# EAGLE design untitled (EAGLE 6.4)
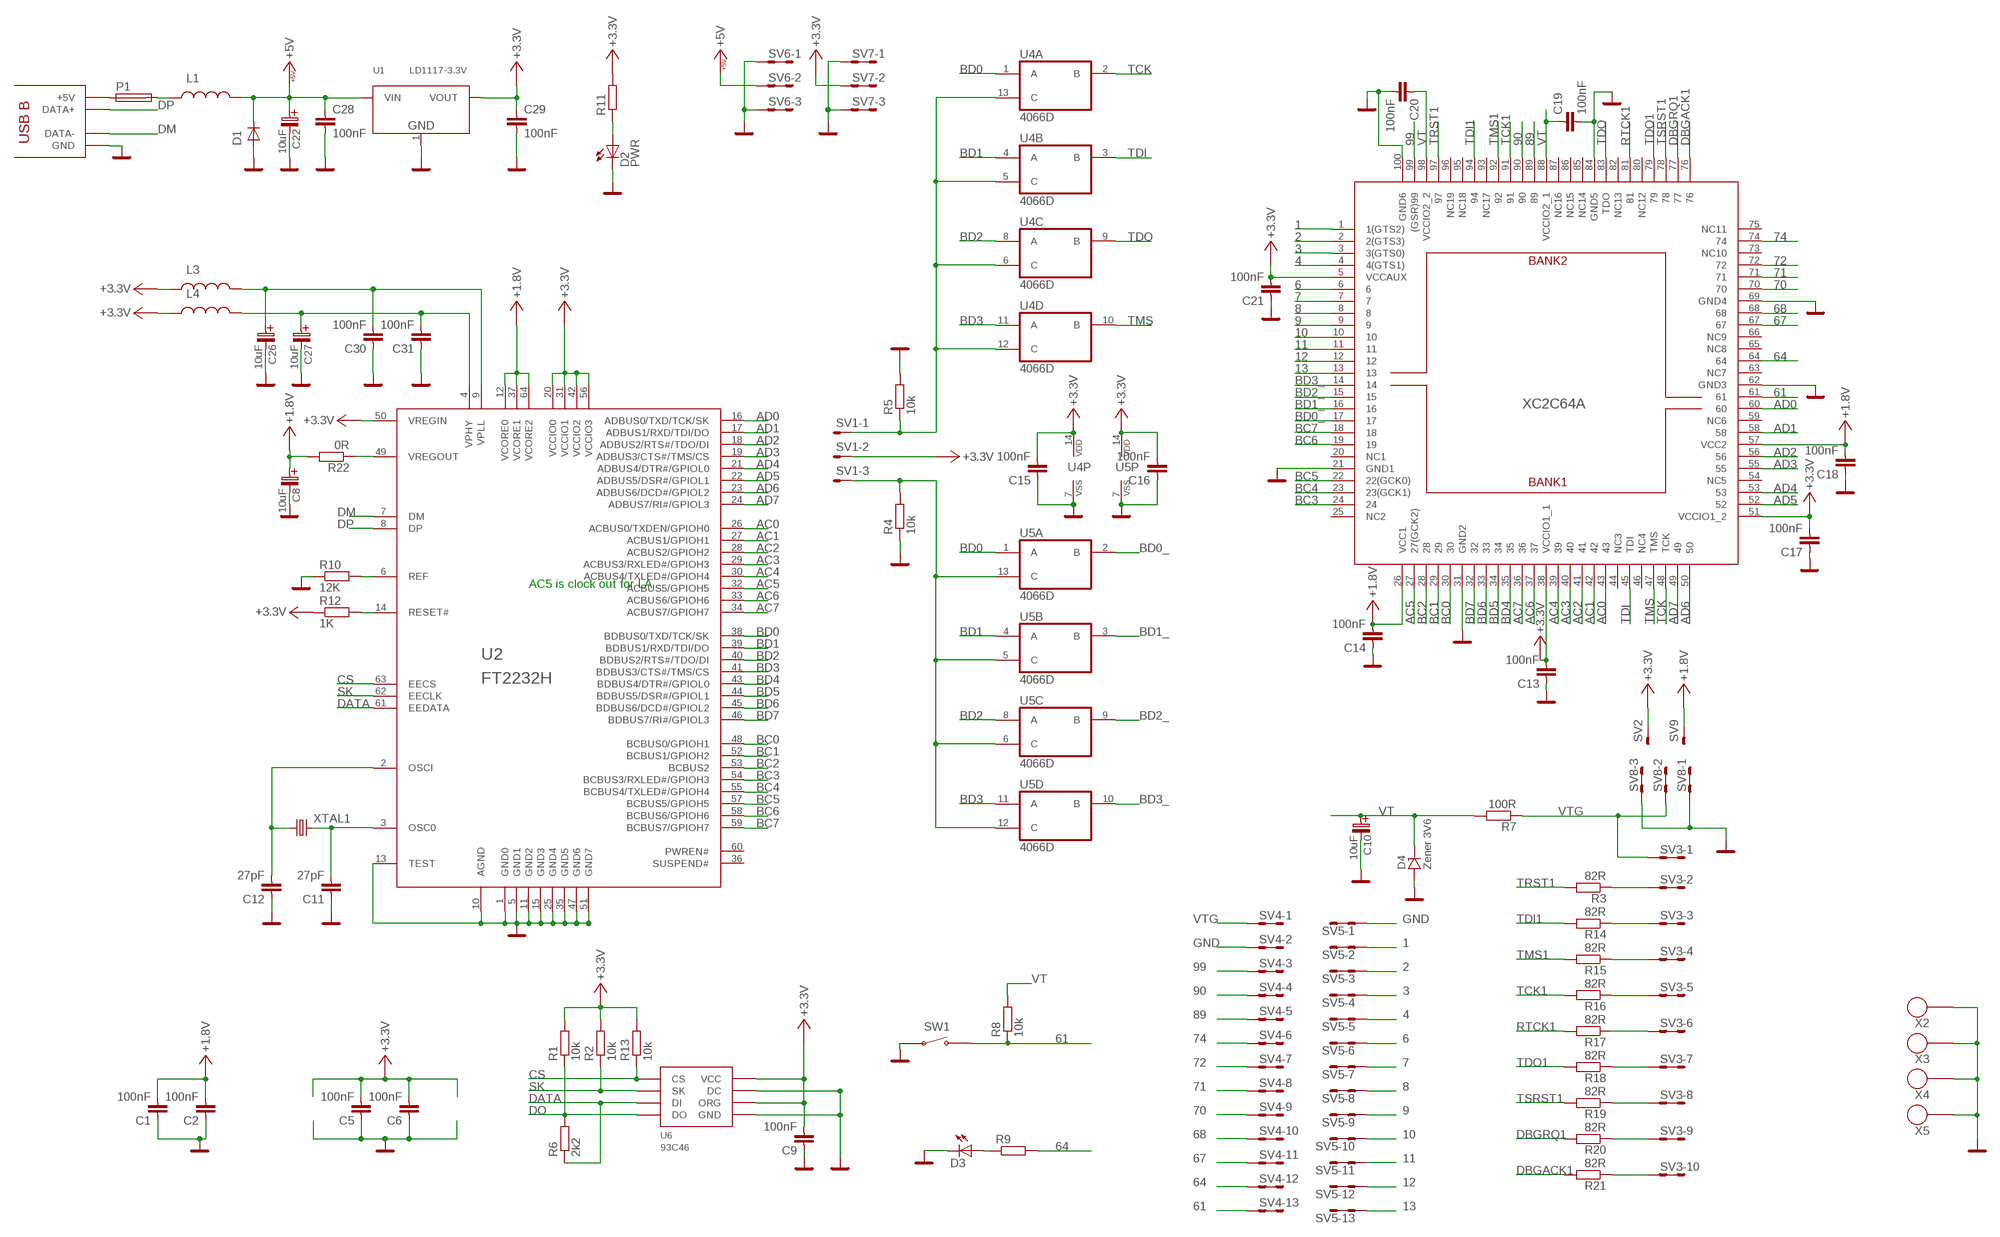
[diagram p0: schematic, sheet 1]

## Parts
C1  100nF  C0805  [C0805]
C2  100nF  C0805  [C0805]
C5  100nF  C0805  [C0805]
C6  100nF  C0805  [C0805]
C8  10uF  B  [B]
C9  100nF  C0805  [C0805]
C10  10uF  B  [B]
C11  27pF  C0805  [C0805]
C12  27pF  C0805  [C0805]
C13  100nF  C0805  [C0805]
C14  100nF  C0805  [C0805]
C15  100nF  C0805  [C0805]
C16  100nF  C0805  [C0805]
C17  100nF  C0805  [C0805]
C18  100nF  C0805  [C0805]
C19  100nF  C0805  [C0805]
C20  100nF  C0805  [C0805]
C21  100nF  C0805  [C0805]
C22  10uF  B  [B]
C26  10uF  B  [B]
C27  10uF  B  [B]
C28  100nF  C0805  [C0805]
C29  100nF  C0805  [C0805]
C30  100nF  C0805  [C0805]
C31  100nF  C0805  [C0805]
D1  D-OB.SMA  [SMA]
D2  PWR  LED1206  [1206]
D3  LED1206  [1206]
D4  Zener 3V6  D-ZENEROVA  [MINIMELF]
L1  L0805  [L0805]
L3  L1210  [1210]
L4  L1210  [1210]
P1  POJISTKA_1812  [1812]
R1  10k  R0805  [0805]
R2  10k  R0805  [0805]
R3  82R  R0805  [0805]
R4  10k  R0805  [0805]
R5  10k  R0805  [0805]
R6  2k2  R0805  [0805]
R7  100R  R0805  [0805]
R8  10k  R0805  [0805]
R9  R0805  [0805]
R10  12K  R0805  [0805]
R11  R0805  [0805]
R12  1K  R0805  [0805]
R13  10k  R0805  [0805]
R14  82R  R0805  [0805]
R15  82R  R0805  [0805]
R16  82R  R0805  [0805]
R17  82R  R0805  [0805]
R18  82R  R0805  [0805]
R19  82R  R0805  [0805]
R20  82R  R0805  [0805]
R21  82R  R0805  [0805]
R22  0R  R0805  [0805]
SV1  MA03-1  [MA03-1]
SV2  MA01-1  [MA01-1]
SV3  MA10-2  [MA10-2]
SV4  MA13-2  [MA13-2]
SV5  MA13-2  [MA13-2]
SV6  MA03-2  [MA03-2]
SV7  MA03-2  [MA03-2]
SV8  MA03-2  [MA03-2]
SV9  MA01-1  [MA01-1]
SW1  TACT-64K  [TACT-64K]
U1  LD1117-3.3V  LD1117-3.3SOT223  [SOT223]
U2  FT2232H  [LQFP64]
U3  XC2C64A  [VQ100]
U4  4066D  [SO14]
U5  4066D  [SO14]
U6  93C46  [SOIC8]
X1  USB_B  [USB_B]
X2  SROUB3M  [SROUB3M]
X3  SROUB3M  [SROUB3M]
X4  SROUB3M  [SROUB3M]
X5  SROUB3M  [SROUB3M]
XTAL1  KRYSLAL_S49  [S49]

## Nets
1: SV5.3 SV5.4 U3.1(1(GTS2))
2: SV5.5 SV5.6 U3.2(2(GTS3))
3: SV5.7 SV5.8 U3.3(3(GTS0))
4: SV5.9 SV5.10 U3.4(4(GTS1))
6: SV5.11 SV5.12 U3.6
7: SV5.13 SV5.14 U3.7
8: SV5.15 SV5.16 U3.8
9: SV5.17 SV5.18 U3.9
10: SV5.19 SV5.20 U3.10
11: SV5.21 SV5.22 U3.11
12: SV5.23 SV5.24 U3.12
13: SV5.25 SV5.26 U3.13
61: R8.1 SV4.25 SV4.26 SW1.P$3 SW1.P$4 U3.61
64: R9.2 SV4.23 SV4.24 U3.64
67: SV4.21 SV4.22 U3.67
68: SV4.19 SV4.20 U3.68
70: SV4.17 SV4.18 U3.70
71: SV4.15 SV4.16 U3.71
72: SV4.13 SV4.14 U3.72
74: SV4.11 SV4.12 U3.74
89: SV4.9 SV4.10 U3.89
90: SV4.7 SV4.8 U3.90
99: SV4.5 SV4.6 U3.99((GSR)99)
+1.8V: C1.2 C2.2 C8.+(C_EL+) C14.2 C18.2 R22.2 SV9.1 U2.12(VCORE0) U2.37(VCORE1) U2.64(VCORE2) U3.26(VCC1) U3.57(VCC2)
+3.3V: C5.2 C6.2 C9.2 C13.2 C15.2 C16.2 C17.2 C21.2 C29.1 L3.P$1 L4.P$1 R1.2 R2.2 R11.2 R12.1 R13.2 SV1.2 SV2.1 SV7.3 SV7.4 U1.2(VOUT) U2.20(VCCIO0) U2.31(VCCIO1) U2.42(VCCIO2) U2.50(VREGIN) U2.56(VCCIO3) U3.5(VCCAUX) U3.38(VCCIO1_1) U3.51(VCCIO1_2) U4.14(P:VDD) U5.14(P:VDD) U6.6(ORG) U6.8(VCC)
+5V: C22.+(C_EL+) C28.1 D1.K(C) L1.2 SV6.3 SV6.4 U1.3(VIN)
AC0: U2.26(ACBUS0/TXDEN/GPIOH0) U3.43
AC1: U2.27(ACBUS1/GPIOH1) U3.42
AC2: U2.28(ACBUS2/GPIOH2) U3.41
AC3: U2.29(ACBUS3/RXLED#/GPIOH3) U3.40
AC4: U2.30(ACBUS4/TXLED#/GPIOH4) U3.39
AC5: U2.32(ACBUS5/GPIOH5) U3.27(27(GCK2))
AC6: U2.33(ACBUS6/GPIOH6) U3.37
AC7: U2.34(ACBUS7/GPIOH7) U3.36
AD0: U2.16(ADBUS0/TXD/TCK/SK) U3.60
AD1: U2.17(ADBUS1/RXD/TDI/DO) U3.58
AD2: U2.18(ADBUS2/RTS#/TDO/DI) U3.56
AD3: U2.19(ADBUS3/CTS#/TMS/CS) U3.55
AD4: U2.21(ADBUS4/DTR#/GPIOL0) U3.53
AD5: U2.22(ADBUS5/DSR#/GPIOL1) U3.52
AD6: U2.23(ADBUS6/DCD#/GPIOL2) U3.50
AD7: U2.24(ADBUS7/RI#/GPIOL3) U3.49
BC0: U2.48(BCBUS0/GPIOH1) U3.30
BC1: U2.52(BCBUS1/GPIOH2) U3.29
BC2: U2.53(BCBUS2) U3.28
BC3: U2.54(BCBUS3/RXLED#/GPIOH3) U3.24
BC4: U2.55(BCBUS4/TXLED#/GPIOH4) U3.23(23(GCK1))
BC5: U2.57(BCBUS5/GPIOH5) U3.22(22(GCK0))
BC6: U2.58(BCBUS6/GPIOH6) U3.19
BC7: U2.59(BCBUS7/GPIOH7) U3.18
BD0: U2.38(BDBUS0/TXD/TCK/SK) U4.1(A:A) U5.1(A:A)
BD0_: U3.17 U5.2(A:B)
BD1: U2.39(BDBUS1/RXD/TDI/DO) U4.4(B:A) U5.4(B:A)
BD1_: U3.16 U5.3(B:B)
BD2: U2.40(BDBUS2/RTS#/TDO/DI) U4.8(C:A) U5.8(C:A)
BD2_: U3.15 U5.9(C:B)
BD3: U2.41(BDBUS3/CTS#/TMS/CS) U4.11(D:A) U5.11(D:A)
BD3_: U3.14 U5.10(D:B)
BD4: U2.43(BDBUS4/DTR#/GPIOL0) U3.35
BD5: U2.44(BDBUS5/DSR#/GPIOL1) U3.34
BD6: U2.45(BDBUS6/DCD#/GPIOL2) U3.33
BD7: U2.46(BDBUS7/RI#/GPIOL3) U3.32
CS: R13.1 U2.63(EECS) U6.1(CS)
DATA: R6.1 U2.61(EEDATA) U6.3(DI)
DBGACK1: R21.2 U3.76
DBGRQ1: R20.2 U3.77
DM: U2.7(DM) X1.2(DATA-)
DO: R1.1 R6.2 U6.4(DO)
DP: U2.8(DP) X1.3(DATA+)
GND: C1.1 C2.1 C5.1 C6.1 C8.-(C_EL-) C9.1 C10.-(C_EL-) C11.1 C12.1 C13.1 C14.1 C15.1 C16.1 C17.1 C18.1 C19.2 C20.2 C21.1 C22.-(C_EL-) C26.-(C_EL-) C27.-(C_EL-) C28.2 C29.2 C30.1 C31.1 D1.A D2.K(C) D3.K(C) D4.A R4.1 R5.2 R10.1 SV4.3 SV4.4 SV5.1 SV5.2 SV6.1 SV6.2 SV6.5 SV6.6 SV7.1 SV7.2 SV7.5 SV7.6 SV8.1 SV8.2 SV8.5 SV8.6 SW1.P$1 SW1.P$2 U1.1(GND) U2.1(GND0) U2.5(GND1) U2.10(AGND) U2.11(GND2) U2.13(TEST) U2.15(GND3) U2.25(GND4) U2.35(GND5) U2.47(GND6) U2.51(GND7) U3.21(GND1) U3.31(GND2) U3.62(GND3) U3.69(GND4) U3.84(GND5) U3.100(GND6) U4.7(P:VSS) U5.7(P:VSS) U6.5(GND) U6.7(DC) X1.4(GND) X1.GND X1.GND2(GND) X2.P$1 X3.P$1 X4.P$1 X5.P$1
N$1: C11.2 U2.3(OSC0) XTAL1.P$2
N$2: C12.2 U2.2(OSCI) XTAL1.P$1
N$3: R10.2 U2.6(REF)
N$4: R12.2 U2.14(RESET#)
N$5: R3.1 SV3.3 SV3.4
N$6: D3.A R9.1
N$7: D2.A R11.1
N$8: P1.1 X1.1(+5V)
N$9: L1.1 P1.2
N$10: R14.1 SV3.5 SV3.6
N$11: R15.1 SV3.7 SV3.8
N$12: R16.1 SV3.9 SV3.10
N$13: R17.1 SV3.11 SV3.12
N$14: R18.1 SV3.13 SV3.14
N$15: R19.1 SV3.15 SV3.16
N$16: R20.1 SV3.17 SV3.18
N$17: R21.1 SV3.19 SV3.20
N$18: R22.1 U2.49(VREGOUT)
N$72: R5.1 SV1.1 U4.5(B:C) U4.6(C:C) U4.12(D:C) U4.13(A:C)
N$73: R4.2 SV1.3 U5.5(B:C) U5.6(C:C) U5.12(D:C) U5.13(A:C)
RTCK1: R17.2 U3.81
SK: R2.1 U2.62(EECLK) U6.2(SK)
TCK: U3.48(TCK) U4.2(A:B)
TCK1: R16.2 U3.91
TDI: U3.45(TDI) U4.3(B:B)
TDI1: R14.2 U3.94
TDO: U3.83(TDO) U4.9(C:B)
TDO1: R18.2 U3.79
TMS: U3.47(TMS) U4.10(D:B)
TMS1: R15.2 U3.92
TRST1: R3.2 U3.97
TSRST1: R19.2 U3.78
VPHY: C27.+(C_EL+) C31.2 L4.P$2 U2.4(VPHY)
VPLL: C26.+(C_EL+) C30.2 L3.P$2 U2.9(VPLL)
VT: C10.+(C_EL+) C19.1 C20.1 D4.C(K) R7.2 R8.2 U3.88(VCCIO2_1) U3.98(VCCIO2_2)
VTG: R7.1 SV3.1 SV3.2 SV4.1 SV4.2 SV8.3 SV8.4
Unconnected: U2.36(SUSPEND#) U2.60(PWREN#) U3.20(NC1) U3.25(NC2) U3.44(NC3) U3.46(NC4) U3.54(NC5) U3.59(NC6) U3.63(NC7) U3.65(NC8) U3.66(NC9) U3.73(NC10) U3.75(NC11) U3.80(NC12) U3.82(NC13) U3.85(NC14) U3.86(NC15) U3.87(NC16) U3.93(NC17) U3.95(NC18) U3.96(NC19)

## Notes on the sheet
- XC2C64A
- AC5 is clock out for LA

## Library data of the parts
C1 C2 C5 C6 C9 C11-C21 C28-C31 = moje_C:C0805
C8 C10 C22 C26 C27 = moje_C:B
D1 = moje:D-OB.SMA: SMA
D2 D3 = moje_diody:LED1206: Ecom LEDS-HCL-1505
D4 = moje_diody:D-ZENEROVA
L1 = moje_L:L0805
L3 L4 = moje_L:L1210
P1 = moje:POJISTKA_1812: Pojistka s pouzdrem 1812
R1-R22 = moje_R:R0805
SV1 = moje_hrebinky:MA03-1: PIN HEADER; OC_FARNELL: unknown; OC_NEWARK: unknown
SV2 SV9 = moje_hrebinky:MA01-1
SV3 = moje_hrebinky:MA10-2: PIN HEADER; OC_FARNELL: unknown; OC_NEWARK: unknown
SV4 SV5 = moje_hrebinky:MA13-2: PIN HEADER; OC_FARNELL: unknown; OC_NEWARK: unknown
SV6-SV8 = moje_hrebinky:MA03-2: PIN HEADER; OC_FARNELL: unknown; OC_NEWARK: unknown
SW1 = moje_tlacitka:TACT-64K: Resetovací tlačítko TACT-64K
U1 = dp_devices:LD1117-3.3
U2 = dp_devices:FT2232H: DUAL HIGH SPEED USB TO MULTIPURPOSE UART/FIFO IC
U3 = fpga:XC2C64A
U4 U5 = 40xx:4066: Quad bilateral ANALOG SWITCH
U6 = DP-EagleLibrary:93C46
X1 = moje_konektory:USB_B
X2-X5 = moje:SROUB3M
XTAL1 = moje_krystaly:KRYSLAL_S49

## Board
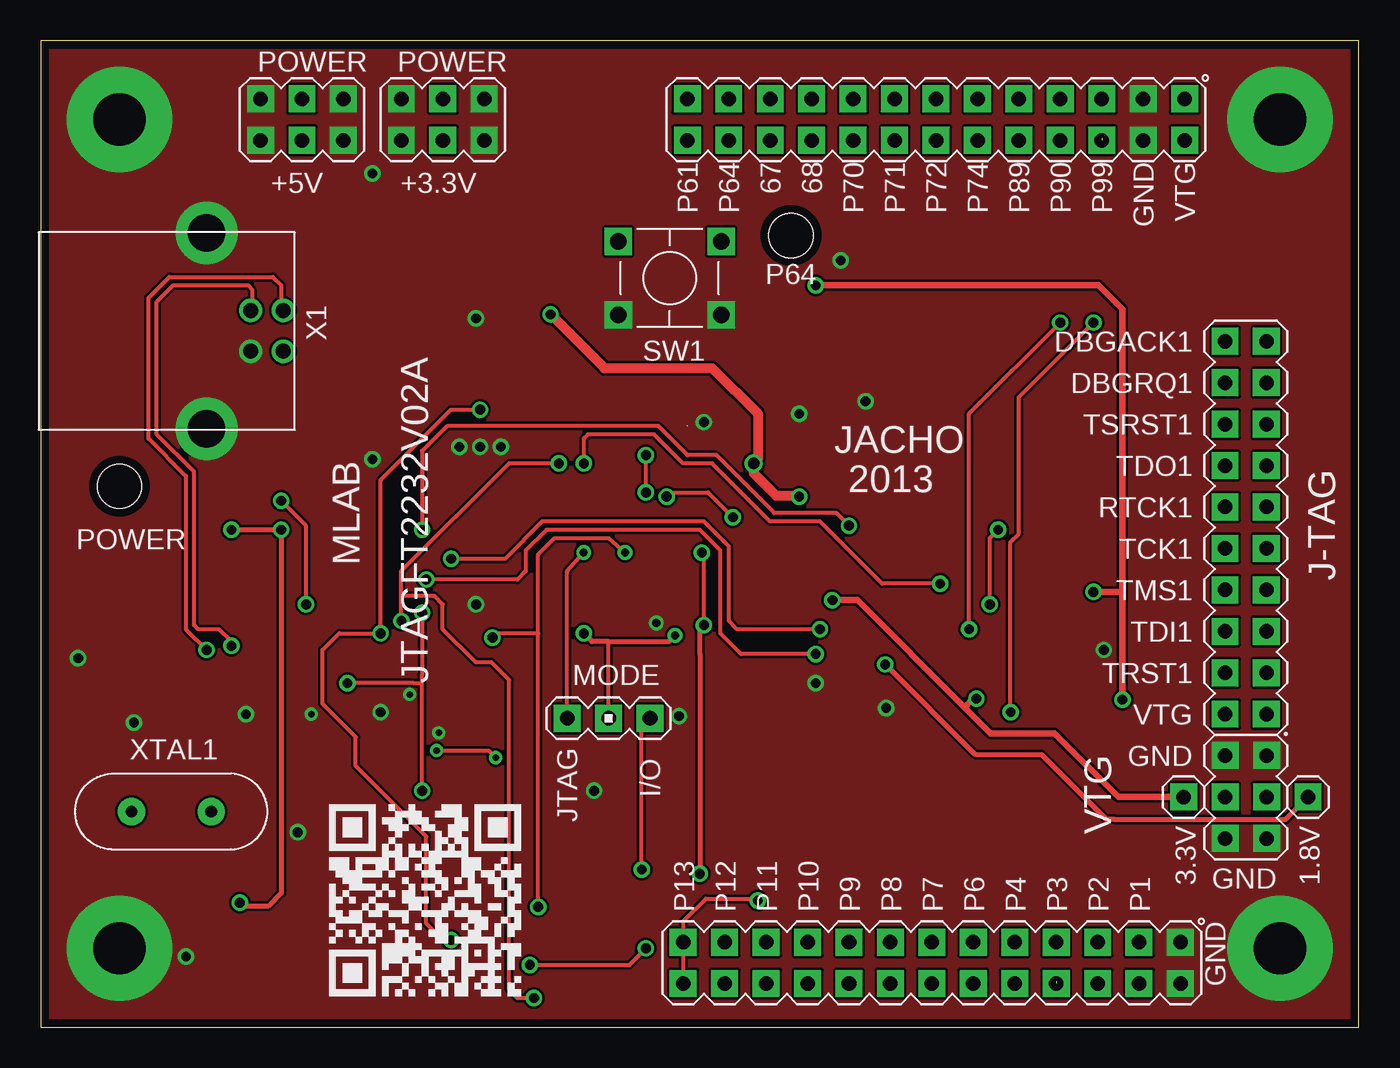
[diagram p1: board, top side]
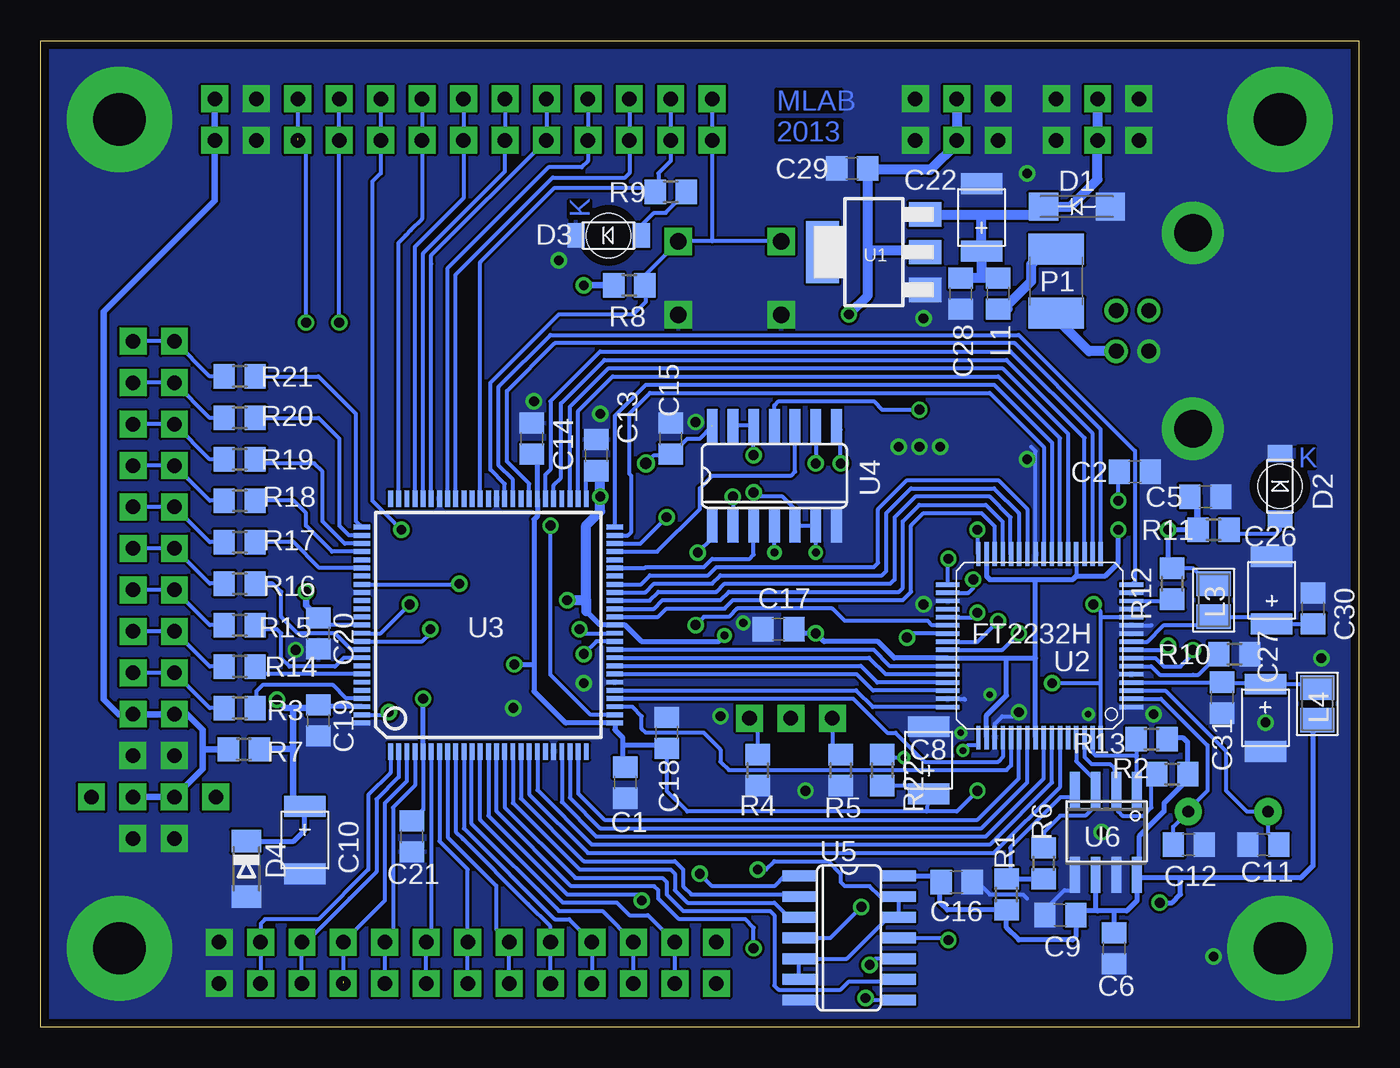
[diagram p2: board, bottom side, seen from below]

Size 80.77 x 60.45 mm. Coordinates in mm from the lower left corner, seen from the top.
Outline: 0,0 80.77,0 80.77,60.45 0,60.45 0,0
Copper layers (1*16): Top 0.035mm / dielectric 1.5mm / Bottom 0.035mm
Design rules "jacho": minimum track width 8mil, minimum drill 16mil, track to track 6mil, track to pad 6mil, pad to pad 6mil, via to via 6mil, smd to smd 6mil, copper to edge 20mil, drill to drill 8mil, minimum pad ring 10mil, minimum via ring 8mil, stop-mask expansion 4mil, vias tented up to drill 25mil, thermal gap 0mil

### Footprints (pad centres in the part's own frame; a part is rotated, then mirrored left to right if it is on the bottom)
C0805 = smd 1.3 x 1.5: 1 -0.95,0; 2 0.95,0
B = smd 1.27 x 2.54: + 2.223,0; - -1.905,0
SMA = smd 1.8 x 1.7: A -2.05,0; K 2.05,0
1206 = smd 1.5 x 1.05: A 0,-2; K 0,2 | hole 2.7: 0,0
MINIMELF = smd 1.4 x 1.8: A 1.7,0; C -1.7,0
L0805 = smd 1.3 x 1.5: 1 -0.95,0; 2 0.95,0
1210 = smd 1.5 x 2.1: P$1 -1,0; P$2 1,0
1812 = smd 1.9 x 3.4: 1 -1.95,0; 2 1.95,0
0805 = smd 1.3 x 1.5: 1 -0.95,0; 2 0.95,0
MA03-1 = drill 0.889 pad 1.651 square: 1 -2.54,0; 2 0,0; 3 2.54,0
MA01-1 = drill 0.889 pad 1.651 square: 1 0,0
MA10-2 = drill 0.889 pad 1.651 square: 1 -11.43,-1.27; 2 -11.43,1.27; 3 -8.89,-1.27; 4 -8.89,1.27; 5 -6.35,-1.27; 6 -6.35,1.27; 7 -3.81,-1.27; 8 -3.81,1.27; 9 -1.27,-1.27; 10 -1.27,1.27; 11 1.27,-1.27; 12 1.27,1.27; 13 3.81,-1.27; 14 3.81,1.27; 15 6.35,-1.27; 16 6.35,1.27; 17 8.89,-1.27; 18 8.89,1.27; 19 11.43,-1.27; 20 11.43,1.27
MA13-2 = drill 0.889 pad 1.651 square: 1 -15.24,-1.27; 2 -15.24,1.27; 3 -12.7,-1.27; 4 -12.7,1.27; 5 -10.16,-1.27; 6 -10.16,1.27; 7 -7.62,-1.27; 8 -7.62,1.27; 9 -5.08,-1.27; 10 -5.08,1.27; 11 -2.54,-1.27; 12 -2.54,1.27; 13 0,-1.27; 14 0,1.27; 15 2.54,-1.27; 16 2.54,1.27; 17 5.08,-1.27; 18 5.08,1.27; 19 7.62,-1.27; 20 7.62,1.27; 21 10.16,-1.27; 22 10.16,1.27; 23 12.7,-1.27; 24 12.7,1.27; 25 15.24,-1.27; 26 15.24,1.27
MA03-2 = drill 0.889 pad 1.651 square: 1 -2.54,-1.27; 2 -2.54,1.27; 3 0,-1.27; 4 0,1.27; 5 2.54,-1.27; 6 2.54,1.27
TACT-64K = drill 1 pad 1.676 square: P$1 -3.15,2.25; P$2 3.15,2.25; P$3 -3.15,-2.25; P$4 3.15,-2.25
SOT223 = smd 1.5 x 2: 1 -2.3,-3.15; 2 0,-3.15; 3 2.3,-3.15 | smd 3.8 x 2: 4 0,3.15
LQFP64 = smd 1.45 x 0.27: 1 -5.625,3.75; 2 -5.625,3.25; 3 -5.625,2.75; 4 -5.625,2.25; 5 -5.625,1.75; 6 -5.625,1.25; 7 -5.625,0.75; 8 -5.625,0.25; 9 -5.625,-0.25; 10 -5.625,-0.75; 11 -5.625,-1.25; 12 -5.625,-1.75; 13 -5.625,-2.25; 14 -5.625,-2.75; 15 -5.625,-3.25; 16 -5.625,-3.75; 33 5.625,-3.75; 34 5.625,-3.25; 35 5.625,-2.75; 36 5.625,-2.25; 37 5.625,-1.75; 38 5.625,-1.25; 39 5.625,-0.75; 40 5.625,-0.25; 41 5.625,0.25; 42 5.625,0.75; 43 5.625,1.25; 44 5.625,1.75; 45 5.625,2.25; 46 5.625,2.75; 47 5.625,3.25; 48 5.625,3.75 | smd 0.27 x 1.45: 17 -3.75,-5.625; 18 -3.25,-5.625; 19 -2.75,-5.625; 20 -2.25,-5.625; 21 -1.75,-5.625; 22 -1.25,-5.625; 23 -0.75,-5.625; 24 -0.25,-5.625; 25 0.25,-5.625; 26 0.75,-5.625; 27 1.25,-5.625; 28 1.75,-5.625; 29 2.25,-5.625; 30 2.75,-5.625; 31 3.25,-5.625; 32 3.75,-5.625; 49 3.75,5.625; 50 3.25,5.625; 51 2.75,5.625; 52 2.25,5.625; 53 1.75,5.625; 54 1.25,5.625; 55 0.75,5.625; 56 0.25,5.625; 57 -0.25,5.625; 58 -0.75,5.625; 59 -1.25,5.625; 60 -1.75,5.625; 61 -2.25,5.625; 62 -2.75,5.625; 63 -3.25,5.625; 64 -3.75,5.625
VQ100 = smd 1 x 0.3: 1 -7.75,6; 2 -7.75,5.5; 3 -7.75,5; 4 -7.75,4.5; 5 -7.75,4; 6 -7.75,3.5; 7 -7.75,3; 8 -7.75,2.5; 9 -7.75,2; 10 -7.75,1.5; 11 -7.75,1; 12 -7.75,0.5; 13 -7.75,0; 14 -7.75,-0.5; 15 -7.75,-1; 16 -7.75,-1.5; 17 -7.75,-2; 18 -7.75,-2.5; 19 -7.75,-3; 20 -7.75,-3.5; 21 -7.75,-4; 22 -7.75,-4.5; 23 -7.75,-5; 24 -7.75,-5.5; 25 -7.75,-6; 51 7.75,-6; 52 7.75,-5.5; 53 7.75,-5; 54 7.75,-4.5; 55 7.75,-4; 56 7.75,-3.5; 57 7.75,-3; 58 7.75,-2.5; 59 7.75,-2; 60 7.75,-1.5; 61 7.75,-1; 62 7.75,-0.5; 63 7.75,0; 64 7.75,0.5; 65 7.75,1; 66 7.75,1.5; 67 7.75,2; 68 7.75,2.5; 69 7.75,3; 70 7.75,3.5; 71 7.75,4; 72 7.75,4.5; 73 7.75,5; 74 7.75,5.5; 75 7.75,6 | smd 0.3 x 1: 26 -6,-7.75; 27 -5.5,-7.75; 28 -5,-7.75; 29 -4.5,-7.75; 30 -4,-7.75; 31 -3.5,-7.75; 32 -3,-7.75; 33 -2.5,-7.75; 34 -2,-7.75; 35 -1.5,-7.75; 36 -1,-7.75; 37 -0.5,-7.75; 38 0,-7.75; 39 0.5,-7.75; 40 1,-7.75; 41 1.5,-7.75; 42 2,-7.75; 43 2.5,-7.75; 44 3,-7.75; 45 3.5,-7.75; 46 4,-7.75; 47 4.5,-7.75; 48 5,-7.75; 49 5.5,-7.75; 50 6,-7.75; 76 6,7.75; 77 5.5,7.75; 78 5,7.75; 79 4.5,7.75; 80 4,7.75; 81 3.5,7.75; 82 3,7.75; 83 2.5,7.75; 84 2,7.75; 85 1.5,7.75; 86 1,7.75; 87 0.5,7.75; 88 0,7.75; 89 -0.5,7.75; 90 -1,7.75; 91 -1.5,7.75; 92 -2,7.75; 93 -2.5,7.75; 94 -3,7.75; 95 -3.5,7.75; 96 -4,7.75; 97 -4.5,7.75; 98 -5,7.75; 99 -5.5,7.75; 100 -6,7.75
SO14 = smd 0.66 x 2.032: 1 -3.81,-3.073; 2 -2.54,-3.073; 3 -1.27,-3.073; 4 0,-3.073; 5 1.27,-3.073; 6 2.54,-3.073; 7 3.81,-3.073; 8 3.81,3.073; 9 2.54,3.073; 10 1.27,3.073; 11 0,3.073; 12 -1.27,3.073; 13 -2.54,3.073; 14 -3.81,3.073
SOIC8 = smd 0.6 x 2.2: 1 -1.905,-2.6; 2 -0.635,-2.6; 3 0.635,-2.6; 4 1.905,-2.6; 5 1.905,2.6; 6 0.635,2.6; 7 -0.635,2.6; 8 -1.905,2.6
USB_B = drill 0.92 pad 1.422: 1 1.25,4.7; 2 -1.25,4.7; 3 -1.25,2.7; 4 1.25,2.7 | drill 2.3 pad 3.81: GND -6,0; GND2 6,0
SROUB3M = drill 3.2 pad 6.452: P$1 0,0
S49 = drill 0.711 pad 1.676: P$1 2.44,0; P$2 -2.44,0

### Placement (x,y rotation side)
C1  44.96,14.99 90 bottom
C2  13.72,34.04 180 bottom
C5  9.4,32.51 180 bottom
C6  14.99,4.83 90 bottom
C8  26.35,16.51 270 bottom
C9  18.29,6.86 0 bottom
C10  64.59,11.3 90 bottom
C11  5.84,11.18 0 bottom
C12  10.41,11.18 180 bottom
C13  46.74,35.05 270 bottom
C14  50.67,36.07 270 bottom
C15  42.16,36.07 270 bottom
C16  24.64,8.89 180 bottom
C17  35.56,24.38 0 bottom
C18  42.42,18.03 270 bottom
C19  63.75,18.8 270 bottom
C20  63.75,24.13 270 bottom
C21  58.04,11.68 90 bottom
C22  23.11,49.78 270 bottom
C26  5.33,26.92 270 bottom
C27  5.71,18.8 90 bottom
C28  24.38,44.96 270 bottom
C29  31.04,52.63 180 bottom
C30  2.79,25.65 270 bottom
C31  8.38,20.19 90 bottom
D1  17.27,50.29 180 bottom
D2  4.83,33.15 0 bottom
D3  45.97,48.51 90 bottom
D4  68.17,9.7 270 bottom
L1  22.1,44.96 90 bottom
L3  8.89,26.16 270 bottom
L4  2.54,19.81 90 bottom
P1  18.54,45.72 90 bottom
R1  21.59,8.13 270 bottom
R2  11.43,15.49 0 bottom
R3  68.58,19.56 0 bottom
R4  36.83,15.75 90 bottom
R5  31.75,15.75 270 bottom
R6  19.3,10.03 270 bottom
R7  68.33,17.02 0 bottom
R8  44.7,45.47 180 bottom
R9  42.16,51.18 180 bottom
R10  7.62,22.86 180 bottom
R11  8.89,30.48 180 bottom
R12  11.43,27.18 270 bottom
R13  12.7,17.65 0 bottom
R14  68.58,22.1 0 bottom
R15  68.58,24.64 0 bottom
R16  68.58,27.18 0 bottom
R17  68.58,29.72 0 bottom
R18  68.58,32.26 0 bottom
R19  68.58,34.8 0 bottom
R20  68.58,37.34 0 bottom
R21  68.58,39.88 0 bottom
R22  29.21,15.75 270 bottom
SV1  34.8,18.92 0 top
SV2  70.05,14.1 0 top
SV3  73.85,30.61 90 top
SV4  54.86,55.63 180 top
SV5  54.61,3.94 180 top
SV6  16,55.63 0 top
SV7  24.64,55.63 0 top
SV8  73.86,14.1 90 top
SV9  77.67,14.1 0 top
SW1  38.54,45.91 180 top
U1  29.72,47.5 90 bottom
U2  19.56,23.37 180 bottom
U3  53.34,24.64 90 bottom
U4  35.81,33.78 0 bottom
U5  31.24,5.46 270 bottom
U6  15.49,11.94 180 bottom
X1  10.16,42.67 270 top
X2  4.83,4.83 0 top
X3  4.83,55.63 90 top
X4  75.95,4.83 0 top
X5  75.95,55.63 0 top
XTAL1  8,13.21 0 top

### Tracks (layer width: path | path; a pad name or v marks a point on that pad's centre or on a via)
1
  Bottom 0.254: U3.1 59.34,15.59 60.71,14.22 60.71,9.65 63.75,6.6 67.03,6.6 67.3,6.34 67.3,5.22 SV5.3 | SV5.3 SV5.4 | SV5.3 67.31,5.33
2
  Bottom 0.254: U3.2 58.84,15.33 60.2,13.97 60.2,9.53 61.85,7.87 64.52,5.21 SV5.5 SV5.6
3  (1 unrouted)
  Bottom 0.254: U3.3 58.34,15.07 59.69,13.72 59.69,8 59.69,7.75 SV5.7 62.23,5.08 62.23,2.79 62.1,2.67
4
  Bottom 0.254: U3.4 57.84,14.8 59.18,13.46 59.18,5.71 SV5.9 SV5.10
6
  Bottom 0.254: SV5.12 SV5.11 56.84,5.52 U3.6
7
  Bottom 0.254: U3.7 56.34,11.38 54.61,9.65 SV5.13 SV5.14
8
  Bottom 0.254: U3.8 55.84,11.64 55.84,11.63 52.87,8.66 52.87,6 SV5.15 SV5.16
9
  Bottom 0.254: SV5.18 SV5.17 49.53,6.16 50.9,7.53 54.89,11.53 55.34,11.97 U3.9
10
  Bottom 0.254: U3.10 54.84,12.17 49.28,6.6 48.39,6.6 SV5.19 SV5.20
11
  Bottom 0.254: U3.11 54.36,16.87 54.36,12.45 49.02,7.11 46.36,7.11 SV5.21 SV5.22
12
  Bottom 0.254: U3.12 53.85,16.88 53.85,12.7 48.77,7.62 45.47,7.62 44.7,6.86 43.56,6.86 SV5.23 SV5.24
13  (via drill 0.6)
  Top 0.254: v43.94,7.75 43.82,7.87 40.77,7.87 39.37,6.48 SV5.25 39.37,4.99 SV5.26
  Bottom 0.254: U3.13 53.34,12.95 48.51,8.13 43.94,8.13 v43.94,7.75
61
  Bottom 0.254: 43.69,45.72 43.69,45.47 43.69,44.45 44.45,43.69 49.02,43.69 53.21,39.5 53.21,34.16 52.34,33.29 U3.61 | SV4.25 SV4.26 39.62,48.48 39.62,48.16 | R8.1 43.75,46.1 42.07,47.79 | 42.07,47.79 SW1.P$3 | SW1.P$4 39.62,48.16 | 39.62,48.16 SW1.P$3 | SW1.P$3 42.07,47.79
  Bottom 0.305: R8.1 43.69,45.47
64
  Bottom 0.254: U3.64 53.84,46.87 49.28,51.44 43.43,51.44 43.18,51.18 R9.2 43.05,51.12 43.05,51.05 42.93,51.18 42.93,52.32 42.16,53.09 SV4.24 SV4.23
67
  Bottom 0.254: U3.67 55.34,46.13 49.4,52.07 44.96,52.07 44.7,52.32 SV4.22 SV4.21
68
  Bottom 0.254: U3.68 55.84,46.52 49.66,52.71 47.62,52.71 47.24,53.09 SV4.20 SV4.19
70
  Bottom 0.254: U3.70 56.84,46.79 56.84,47.3 SV4.18 SV4.17
71
  Bottom 0.254: SV4.15 52.32,54.48 SV4.16 52.32,52.45 57.34,47.44 U3.71
72
  Bottom 0.254: SV4.13 SV4.14 54.86,50.8 56.77,48.9 57.28,48.39 57.84,47.82 U3.72
74
  Bottom 0.254: SV4.11 SV4.12 57.4,49.53 58.1,48.83 58.42,48.51 58.84,48.09 U3.74
89  (via drill 0.6 pad 0.3)
  Top 0.254: v58.17,25.91 58.17,29.97 v58.67,30.48
  Bottom 0.254: U3.89 59.94,24.14 v58.17,25.91 | v58.67,30.48 59.44,31.24 60.45,32.26 60.45,51.82 59.94,52.32 SV4.10 SV4.9
90  (via drill 0.6)
  Top 0.254: v62.48,43.18 56.9,37.59 v56.9,24.38
  Bottom 0.254: U3.90 57.39,23.64 56.9,24.13 v56.9,24.38 | v62.48,43.18 SV4.8 62.48,56.77 SV4.7 62.48,57.02
99  (via drill 0.6 pad 0.3)  (1 unrouted)
  Top 0.254: v59.44,19.3 59.44,29.72 59.94,30.23 59.94,38.61 v64.52,43.18
  Bottom 0.254: U3.99 59.6,19.14 v59.44,19.3 | v64.52,43.18 64.52,53.98 65.02,54.48 | SV4.5 SV4.6
+1.8V  (via drill 0.6, 0.6 pad 0.3)
  Top 0.254: v23.37,14.48 23.37,19.81 23.37,21.08 | v23.37,25.4 23.37,21.59 23.37,21.08 | v18.8,21.08 22.86,21.08 23.37,21.08 | v16.26,25.91 16.26,30.73 v14.73,32.26
  Top 0.305: SV9.1 76.31,12.74 65.78,12.74 65.3,12.74 61.35,16.69 57.29,16.69 v51.75,22.22
  Bottom 0.254: U2.37 23.65,25.12 v23.37,25.4 | 15.81,21.08 U2.64 15.81,19.62 | 15.81,25.15 15.81,25.46 v16.26,25.91 | v18.8,21.08 15.81,21.08 | 42.99,17.27 C18.2 42.42,14.48 41.15,13.21 26.48,13.21 | v23.37,14.48 24.64,13.21 26.48,13.21 | U2.12 15.78,25.12 15.81,25.15 | 15.81,21.08 15.81,25.15 | C2.2 14.99,33.53 14.73,33.53 | 44.45,16.44 C1.2 | v14.73,32.26 14.73,33.53 | 14.73,33.53 14.73,33.78 | 50.34,34.85 50.67,35.18 C14.2 | 26.48,13.21 C8.+ 26.99,14.8 R22.2 | 50.61,22.22 50.55,22.29
  Bottom 0.305: 50.34,34.85 U3.57 50.34,31.32 50.55,31.11 50.55,22.29 50.55,20.57 48.61,18.64 U3.26 45.59,18.22 45.11,17.74 45.11,17.25 | v51.75,22.22 50.61,22.22 | 45.11,17.25 45.11,16.09 C1.2 | 42.99,17.27 45.1,17.27 45.11,17.25
+3.3V  (via drill 0.5, 0.6, 0.6 pad 0.3, 0.7 pad 0.3)  (1 unrouted)
  Top 0.254: SV1.2 34.8,23.62
  Top 0.305: v11.68,30.48 v14.73,30.48 14.73,8.89 14.73,8.22 13.92,7.41 12.4,7.41 v12.19,7.62 | v33.27,24.13 33.78,23.62 34.8,23.62 38.48,23.62 v38.86,24
  Top 0.406: v48.51,26.16 50.04,26.16 56.6,19.61 | 56.6,19.61 58.19,18.01 61.06,18.01 61.16,18.01 62.14,18.01 66.05,14.09 66.16,14.09 SV2.1 | v57.34,20.13 57.12,20.13 56.6,19.61
  Top 0.61: v31.24,43.69 34.54,40.39 41.15,40.39 43.94,37.59 43.94,34.8 v43.69,34.54 43.69,33.95 45.06,32.58 46.42,32.58 v46.48,32.51
  Bottom 0.254: U2.20 17.31,27.65 | 19.81,27.43 | 19.82,22.62 19.81,22.61 | U3.51 47.34,33.69 46.74,34.29 C13.2 | 25.84,9.14 C16.2 25.65,8.89 26.04,9.27 | 11.94,30.48 v11.68,30.48 | 34.8,24.13 C17.2 | C17.2 35.05,24.13 | 39.79,37.02 U4.14 | 39.62,36.83 40.39,36.07 41.15,36.07 42.1,35.12 C15.2 42.23,35.05 43.18,35.05 v43.69,34.54 | 21.59,22.61 20.33,22.61 20.32,22.62 | 17.53,7.11 17.27,7.11 17.34,7.18 C9.2 | 16.13,7.24 16,7.11 | R2.2 10.48,15.17 | 13.46,9.4 13.53,9.4 U6.8 13.39,9.14 | R11.2 9.91,30.48 | 34.36,24.13 C17.2 | 2.79,18.8 2.54,19.05 L4.P$1 2.54,18.8 2.41,18.67 | U3.5 57.34,13.33 C21.2 | U3.5 | R12.1 10.16,28.13 9.39,27.36 9.09,27.36 L3.P$1
  Bottom 0.305: 47.34,25.5 46.48,24.64 U3.38 44.96,24.64 43.94,23.62 39.24,23.62 v38.86,24 | U2.31 22.81,27.63 22.61,27.43 19.81,27.43 17.53,27.43 17.31,27.65 15.53,27.65 14.73,28.45 v14.73,30.48 | U2.56 19.81,22.61 19.81,27.43 | 19.82,22.62 20.32,22.62 U2.42 28.46,22.62 29.46,23.62 32.77,23.62 v33.27,24.13 34.36,24.13 | 21.59,22.61 21.59,20.32 22.81,19.1 U2.50 | 25.65,8.89 25.65,7.62 25.21,7.18 R1.2 21.59,6.1 20.83,5.33 17.53,5.33 17.34,5.52 C9.2 | U5.14 26.04,9.27 | U6.8 13.59,7.75 14.22,7.11 14.99,7.11 | 14.99,7.11 16,7.11 17.27,7.11 | U6.6 16.13,7.24 | R2.2 10.48,17.08 10.48,17.45 10.74,17.71 11.69,17.71 R13.2 | 10.48,15.17 11.94,13.72 11.94,13.21 13.46,11.68 13.46,9.4 | 10.92,9.14 3.56,9.14 2.79,9.91 2.79,18.8 | 10.92,9.14 13.39,9.14 | v12.19,7.62 11.43,7.62 10.92,8.13 10.92,9.14 | 9.91,30.48 v11.68,30.48 11.68,28.38 R12.1 | C6.2 14.99,7.11 | U3.5 v57.34,20.13
  Bottom 0.406: C5.2 9.91,32.51 9.91,30.48
  Bottom 0.61: SV7.4 SV7.3 24.64,54.16 26.25,52.54 30.01,52.54 C29.1 30.09,47.6 | v31.24,43.69 30.09,44.84 30.09,47.6 | U1.2 26.67,47.6 30.09,47.6 | C13.2 46.48,33.85 v46.48,32.51 46.49,32.5 46.49,31.6 47.34,30.75 47.34,26.16 | 47.34,26.16 47.34,25.5 | v48.51,26.16 47.34,26.16
+5V
  Bottom 0.406: 19.56,50.29 D1.K 19.82,49.8 19.83,49.78 23.11,49.78
  Bottom 0.61: L1.2 23.11,45.91 | 23.11,45.91 C28.1 | 23.11,45.91 C22.+ 23.11,49.78 | U1.3 19.82,49.8 | D1.K 17.67,50.29 16.01,51.95 SV6.3 SV6.4
AC0
  Bottom 0.254: U3.43 43.98,27.14 43.43,27.69 39.88,27.69 39.37,28.19 29.72,28.19 29.46,28.45 29.46,31.75 27.69,33.53 22.1,33.53 20.32,31.75 20.32,29 U2.26
AC1
  Bottom 0.254: 20.83,29.01 U2.27 20.81,28.98 20.83,28.96 20.83,31.5 22.35,33.02 27.43,33.02 28.96,31.5 28.96,27.94 29.21,27.69 39.12,27.69 39.62,27.18 43.18,27.18 43.72,26.64 U3.42
AC2
  Bottom 0.254: U3.41 43.46,26.14 42.93,26.67 39.37,26.67 38.86,27.18 28.7,27.18 28.45,27.43 28.45,31.24 27.18,32.51 22.61,32.51 21.34,31.24 21.34,28.96 | 21.34,28.96 | 21.34,28.96 U2.28
AC3
  Bottom 0.254: U3.40 43.2,25.64 42.67,26.16 39.12,26.16 38.61,26.67 28.19,26.67 27.94,26.92 27.94,30.99 26.92,32 22.86,32 21.81,30.95 U2.29
AC4
  Bottom 0.254: U3.39 42.93,25.14 42.42,25.65 38.86,25.65 38.35,26.16 27.94,26.16 27.43,26.67 27.43,30.73 26.67,31.5 23.11,31.5 22.31,30.69 U2.30
AC5  (via drill 0.6 pad 0.3)
  Top 0.254: v49.53,30.73 48.77,31.5 44.96,31.5 41.4,35.05 39.62,35.05 37.85,36.83 24.89,36.83 23.37,35.31 v23.37,30.48
  Bottom 0.254: U3.27 47.08,19.14 49.53,21.59 v49.53,30.73 | v23.37,30.48 23.37,29.05 U2.32
AC6  (via drill 0.6 pad 0.3)
  Top 0.254: v47.75,24.38 42.67,24.38 42.16,24.89 42.16,29.46 40.64,30.99 30.73,30.99 28.45,28.7 v25.15,28.7
  Bottom 0.254: v47.75,24.38 47.5,24.13 45.6,24.13 U3.37 | U2.33 25.18,28.66 v25.15,28.7
AC7  (via drill 0.6 pad 0.3)
  Top 0.254: v47.5,22.86 42.93,22.86 41.66,24.13 41.66,29.21 40.39,30.48 30.99,30.48 29.72,29.21 29.72,27.94 29.21,27.43 v23.62,27.43
  Bottom 0.254: U3.36 46.72,23.64 v47.5,22.86 | U2.34 23.93,26.62 23.62,26.92 v23.62,27.43
AD0
  Bottom 0.254: U3.60 51.84,33.55 52.71,34.42 52.71,39.24 49.53,42.42 20.83,42.42 13.72,35.31 13.72,27.18 13.87,27.18 U2.16
AD1
  Bottom 0.254: U2.17 15.81,36.64 21.08,41.91 49.28,41.91 52.2,38.99 52.2,34.67 50.84,33.31 U3.58
AD2
  Bottom 0.254: U2.18 16.31,36.37 21.34,41.4 46.48,41.4 49.53,38.35 49.53,34.16 49.84,33.85 U3.56
AD3
  Bottom 0.254: U3.55 49.34,33.21 48.9,33.66 48.9,38.23 46.23,40.89 21.59,40.89 16.81,36.11 U2.19
AD4
  Bottom 0.254: U3.53 48.34,38.02 45.97,40.39 21.84,40.39 17.81,36.35 U2.21
AD5
  Bottom 0.254: U3.52 47.84,37.76 45.72,39.88 22.1,39.88 18.31,36.09 U2.22
AD6
  Bottom 0.254: U3.50 45.59,37.47 43.69,39.37 22.35,39.37 18.8,35.81 18.8,28.96 18.81,28.97 U2.23
AD7
  Bottom 0.254: U3.49 44.79,30.14 44.58,30.35 44.58,33.78 44.7,33.91 44.7,37.59 43.43,38.86 22.61,38.86 19.3,35.56 U2.24
BC0
  Bottom 0.254: U3.30 30.8,20.64 29.78,19.62 U2.48
BC1
  Bottom 0.254: U2.52 21.81,16.55 22.1,16.26 26.61,16.26 28.38,18.03 28.89,18.03 31,20.14 31.06,20.14 U3.29
BC2
  Bottom 0.254: U3.28 44.53,19.64 43.94,19.05 43.94,18.29 43.69,18.03 40.13,18.03 39.12,17.02 39.12,16.26 38.61,15.75 21.59,15.75 21.31,16.03 U2.53
BC3
  Bottom 0.254: U3.24 47.84,14.31 46.23,12.7 23.37,12.7 20.83,15.24 20.83,17.72 U2.54
BC4
  Bottom 0.254: U3.23 48.34,14.05 46.48,12.19 23.11,12.19 20.32,14.99 20.32,17.73 U2.55
BC5
  Bottom 0.254: U3.22 48.84,13.79 46.74,11.68 22.86,11.68 19.3,15.24 U2.57
BC6
  Bottom 0.254: U2.58 18.8,17.73 18.8,14.99 22.61,11.18 46.99,11.18 50.34,14.53 U3.19
BC7
  Bottom 0.254: U2.59 18.29,17.72 18.29,14.73 22.35,10.67 47.24,10.67 50.84,14.26 U3.18
BD0  (via drill 0.6 pad 0.3)
  Top 0.254: v40.64,24.64 40.64,28.96 v40.51,29.08
  Top 0.305: v40.39,9.4 40.39,22.86 40.39,24.38 v40.64,24.64
  Bottom 0.254: U2.38 26.14,24.62 26.42,24.89 31.5,24.89 32.26,25.65 38.1,25.65 38.61,25.15 40.13,25.15 v40.64,24.64 | U4.1 39.65,30.73 39.65,29.95 v40.51,29.08 | U5.1 35.18,9.27 35.81,8.64 39.62,8.64 v40.39,9.4
BD0_
  Bottom 0.254: U3.17 51.34,14 47.5,10.16 41.91,10.16 41.4,9.65 41.4,8.64 40.89,8.13 34.54,8.13 34.29,7.87 34.29,7.98 U5.2
BD1  (via drill 0.5 pad 0.3, 0.6 pad 0.3)
  Top 0.254: v30.48,7.37 30.48,24.13 | 30.48,24.13 30.48,28.96 31.5,29.97 34.8,29.97 v35.81,29.08 | 30.48,24.13 27.94,24.13 v27.69,23.88
  Bottom 0.254: U2.39 27.44,24.12 v27.69,23.88 | v35.81,29.08 U4.4 | U5.4 32.39,5.46 v30.48,7.37
BD1_
  Bottom 0.254: U3.16 51.84,13.74 47.75,9.65 42.16,9.65 41.91,9.4 41.91,8.38 41.15,7.62 35.81,7.62 35.05,6.86 34.44,6.86 U5.3 34.44,6.6
BD2  (via drill 0.6 pad 0.3)
  Top 0.254: v22.1,24.89 22.1,26.42 | 22.1,26.42 22.1,27.94 28.7,34.54 v31.75,34.54 | 22.1,26.42 24.13,26.42 24.64,25.91 24.64,24.38 26.67,22.35 27.62,22.35 28.7,21.27 28.7,2.29 29.21,1.78 v30.23,1.78
  Bottom 0.254: U2.40 23.37,23.62 v22.1,24.89 | v31.75,34.54 31.75,36.6 U4.8 | 27.81,1.65 U5.8 30.1,1.65 v30.23,1.78
BD2_
  Bottom 0.254: U3.15 52.34,13.48 48.01,9.14 42.67,9.14 42.42,8.89 42.42,8.13 41.4,7.11 36.07,7.11 35.81,6.86 35.81,2.54 35.56,2.29 31.75,2.29 31.24,2.79 28.7,2.79 28.45,3.05 28.32,2.92 U5.9
BD3  (via drill 0.6 pad 0.3)
  Top 0.254: v25.15,5.33 24.64,5.33 23.62,6.35 23.62,11.68 19.3,16 19.3,17.78 17.27,19.81 17.27,23.11 18.29,24.13 v20.83,24.13 20.83,33.53 25.15,37.85 v26.92,37.85
  Bottom 0.254: U2.41 21.84,23.12 v20.83,24.13 | U4.11 35.81,38.1 35.56,38.35 29.72,38.35 29.21,37.85 v26.92,37.85 | U5.11 25.27,5.46 v25.15,5.33
BD3_  (via drill 0.6 pad 0.3)
  Top 0.254: v29.97,3.81 36.07,3.81 v37.08,4.83
  Bottom 0.254: U3.14 52.83,13.21 48.26,8.64 43.18,8.64 42.93,8.38 42.93,7.87 41.66,6.6 37.59,6.6 37.08,6.1 v37.08,4.83 | U5.10 29.59,4.19 v29.97,3.81
BD4
  Bottom 0.254: U3.35 29.74,23.14 28.72,22.12 U2.43
BD5
  Bottom 0.254: U3.34 30,22.64 28.98,21.62 U2.44
BD6
  Bottom 0.254: U3.33 30.52,22.14 29.5,21.12 U2.45
BD7
  Bottom 0.254: U3.32 30.78,21.64 29.76,20.62 U2.46
CS
  Bottom 0.254: U6.1 13.59,16.64 | 13.59,16.64 13.59,17.59 R13.1 | U2.63 16.31,16.82 16.13,16.64 13.59,16.64
DATA
  Bottom 0.254: 16.26,14.99 16,14.73 16,13.72 16.76,12.95 18.29,12.95 19.3,11.94 R6.1 | 16.26,14.99 16.19,14.99 U6.3 | 16.26,14.99 16.26,15.24 16.13,15.37 16.13,15.11 17.31,16.29 U2.61
DBGACK1
  Bottom 0.254: R21.2 63.75,39.88 61.47,37.59 61.47,31.02 U3.76
DBGRQ1
  Bottom 0.254: R20.2 63.75,37.34 62.48,36.07 62.48,30.73 61.89,30.14 U3.77
DM  (via drill 0.6)
  Top 0.254: X1.2 14.73,44.05 14.73,45.47 14.22,45.97 7.87,45.97 6.6,44.7 6.6,36.07 8.89,33.78 8.89,24.38 v10.16,23.11
  Bottom 0.254: U2.7 12.46,22.62 11.94,22.1 10.92,22.1 10.16,22.86 v10.16,23.11
DO
  Bottom 0.254: 19.43,9.08 R6.2 | 17.4,14.86 U6.4 17.5,14.44 17.5,13.99 17.61,14.09 18.25,14.09 21.34,11.01 21.34,10.92 21.34,9.33 R1.1
  Bottom 0.305: R1.1 19.43,9.08
DP  (via drill 0.6)
  Top 0.254: v11.68,23.37 11.68,23.62 10.92,24.38 9.65,24.38 9.4,24.64 9.4,34.04 7.11,36.32 7.11,44.45 8.13,45.47 12.7,45.47 12.95,45.21 12.95,44.02 X1.3
  Bottom 0.254: U2.8 11.93,23.12 v11.68,23.37
GND  (via drill 0.4 pad 0.3, 0.5 pad 0.3, 0.6 pad 0.3)
  Bottom 0.254: U2.11 12.72,24.62 12.7,24.64 | U2.25 19.81,35.3 20.07,35.56 | U2.51 22.31,18.59 21.84,19.05 21.08,19.05 v20.83,19.3 | U2.47 24.18,20.12 24.13,20.07 | C16.1 23.37,8.89 22.61,8.13 20.57,8.13 20.32,7.87 | C9.1 19.24,7.18 18.03,8.38 17.27,8.38 17.27,9.72 U6.5
  other vias: 51.82,19.56 65.15,23.11 33.91,14.48 26.67,25.91 8.89,4.32 2.29,22.61 39.12,19.05 47.5,21.08 37.72,24.76 40.64,37.08 49.02,46.99 46.48,37.59 50.55,38.35 24.38,18.03 15.75,11.94 26.67,43.43 20.32,52.32 12.57,19.18 5.71,18.67 25.65,35.56 26.92,35.56 28.19,35.56 20.32,34.8 16.57,19.18 22.61,20.38
  pour Bottom: 0,80.01 104.9,80.01 104.9,0.25 0.25,0.25 0.25,79.76
  pour Top: -1.27,80.77 101.09,80.77 101.09,-1.52 -1.27,-1.52
N$1
  Bottom 0.254: 4.83,11.18 5.56,11.91 XTAL1.P$2 6.86,13.21 8.13,14.48 8.13,16.89 11.86,20.62 U2.3 | 4.57,11.18 4.83,11.18 | 4.83,11.18 C11.2
N$2
  Bottom 0.254: C12.2 11.36,12.29 XTAL1.P$1 10.44,13.31 9.27,14.48 9.27,17.27 12.12,20.12 U2.2
N$3
  Bottom 0.254: U2.6 12.72,22.12 12.19,21.59 10.16,21.59 9.84,21.59 R10.2 8.89,22.86
N$4
  Bottom 0.254: U2.14 11.54,26.12 R12.2
N$5
  Bottom 0.254: R3.1 70.42,19.56 SV3.4 SV3.3
N$6
  Bottom 0.254: D3.A 44.22,48.87 43.18,49.91 42.48,49.91 R9.1 41.21,51.25 | 41.15,50.67 41.15,51.18 41.21,51.25 | 41.21,51.25 41.28,51.31
N$7
  Bottom 0.254: D2.A 4.83,30.48 5.08,30.23 7.62,30.23 7.87,30.48 R11.1
N$8
  Bottom 0.406: 18.8,43.69 18.03,43.69 17.78,43.94 18.37,43.94 P1.1
  Bottom 0.61: X1.1 16.53,41.42 18.8,43.69
N$9
  Bottom 0.406: L1.1 21.52,44.01 | 18.29,47.24 18.29,47.42 P1.2
  Bottom 0.61: 21.52,44.01 21.52,44.26 20.07,45.72 20.07,46.74 19.3,47.5 18.54,47.5 18.29,47.24
N$10
  Bottom 0.254: R14.1 70.42,22.1 SV3.6 SV3.5
N$11
  Bottom 0.254: R15.1 70.42,24.64 SV3.8 SV3.7
N$12
  Bottom 0.254: R16.1 70.42,27.18 SV3.10 SV3.9
N$13
  Bottom 0.254: R17.1 70.42,29.72 SV3.12 SV3.11
N$14
  Bottom 0.254: R18.1 70.42,32.26 SV3.14 SV3.13
N$15
  Bottom 0.254: R19.1 70.42,34.8 SV3.16 SV3.15
N$16
  Bottom 0.254: R20.1 70.42,37.34 SV3.18 SV3.17
N$17
  Bottom 0.254: R21.1 70.42,39.88 SV3.20 SV3.19
N$18  (via drill 0.4)
  Top 0.254: v24.26,16.95 27.43,16.95 v27.88,16.51
  Bottom 0.254: U2.49 23.31,17.27 23.94,17.27 v24.26,16.95 | v27.88,16.51 29.02,16.51 R22.1
N$72  (via drill 0.5 pad 0.3, 0.6 pad 0.3)
  Top 0.254: v37.08,32.77 v37.08,35.05 | SV1.1 32.26,27.94 v33.27,29.08
  Bottom 0.254: R5.1 32.26,17.21 SV1.1 | U4.13 U4.12 v37.08,35.05 | v37.08,32.77 36.83,32.51 35.31,32.51 34.54,31.75 U4.5 U4.6 v33.27,29.08
N$73  (via drill 0.6 pad 0.3)
  Top 0.254: v36.83,9.65 36.83,18.41 SV1.3
  Bottom 0.254: U5.6 U5.5 31.37,4.19 28.96,6.6 28.3,6.6 U5.12 U5.13 29.34,8 29.97,8.64 31.5,8.64 31.75,8.89 31.75,9.4 32.51,10.16 35.81,10.16 36.32,9.65 v36.83,9.65 | R4.2 36.83,18.41 SV1.3
RTCK1
  Bottom 0.254: U3.81 63.7,28.14 65.28,29.72 R17.2
SK
  Bottom 0.254: 11.94,15.17 R2.1 12.19,15.49 12.7,14.99 12.7,13.46 13.21,12.95 14.48,12.95 14.73,13.21 14.73,14.48 14.8,14.48 U6.2 14.93,14.54 14.99,14.48 14.99,15.11 | U2.62 16.81,16.55 16.38,16.13 15.24,16.13 14.99,15.88 14.99,15.11 | 14.99,15.11 14.86,14.99
TCK  (via drill 0.6 pad 0.3)
  Top 0.254: v38.35,32.51 38.61,32.77 40.89,32.77 v42.42,31.24
  Bottom 0.254: v38.35,32.51 U4.2 | U3.48 44.02,29.64 v42.42,31.24
TCK1
  Bottom 0.254: U3.91 61.75,23.14 62.74,24.13 65.02,24.13 66.04,25.15 66.04,26.67 66.55,27.18 R16.2
TDI
  Bottom 0.254: 37.08,30.73 U4.3 37.08,28.96 37.34,28.7 39.62,28.7 40.13,28.19 43.69,28.19 43.74,28.14 U3.45
TDI1
  Bottom 0.254: U3.94 67.17,21.64 R14.2
TDO  (via drill 0.6 pad 0.3)
  Top 0.254: v55.12,27.18 51.56,27.18 47.75,30.99 44.7,30.99 41.15,34.54 39.37,34.54 37.59,36.32 33.53,36.32 33.27,36.07 v33.27,34.54
  Bottom 0.254: U4.9 v33.27,34.54 | U3.83 55.16,27.14 v55.12,27.18
TDO1
  Bottom 0.254: U3.79 62.92,29.14 64.52,30.73 64.52,31.5 65.28,32.26 R18.2
TMS
  Bottom 0.254: U3.47 43,29.14 40.39,31.75 40.39,33.02 39.62,33.78 34.8,33.78 34.54,34.04 U4.10
TMS1
  Bottom 0.254: U3.92 62.2,22.64 62.74,22.1 65.53,22.1 66.04,22.61 66.04,24.13 66.29,24.38 67.31,24.38 67.56,24.64 R15.2
TRST1
  Bottom 0.254: U3.97 62.05,20.14 62.87,20.95 67.18,20.95 67.56,20.57 67.56,19.56 R3.2 67.69,19.56
TSRST1
  Bottom 0.254: U3.78 62.15,29.64 63.5,30.99 63.5,34.04 64.01,34.54 67.38,34.54 R19.2
VPHY
  Bottom 0.254: U2.4 8.6,21.12 | 8.6,21.12 8.38,21.34 | 8.6,21.12 8.64,21.08 6.1,21.08 C27.+ 2.73,21.02 | 8.6,21.12 8.6,21.23 C31.2 | 2.73,21.02 2.54,20.83 | 2.73,21.02 2.73,20.88 L4.P$2
VPLL
  Bottom 0.254: U2.9 12.96,23.62 11.94,24.64 9.14,24.64 8.64,25.15 | 8.64,25.15 8.89,25.15 L3.P$2 | 8.64,25.15 5.59,25.15 5.33,24.89 C26.+ C30.2
VT  (via drill 0.6 pad 0.3)
  Top 0.406: v66.29,20.07 66.29,26.71 | 66.29,26.71 66.29,27.04 66.29,42.98 66.29,44.01 66.27,44.03 64.81,45.49 47.52,45.49 v47.5,45.47 | v64.52,26.67 66.25,26.67 66.29,26.71
  Bottom 0.254: U3.88 63.69,24.64 C20.1 | 63.65,19.64 C19.1 63.94,19.56 | 65.97,19.75 v66.29,20.07
  Bottom 0.305: U3.98 63.65,19.64 | 67.35,17.04 R7.2 | D4.C 65.27,11.39 64.59,12.07 C10.+
  Bottom 0.406: 63.94,19.56 64.46,19.56 65.27,19.56 | v66.29,20.07 65.79,19.56 65.27,19.56 | 65.3,17.15 65.3,13.53 65.24,13.47 64.64,13.47 C10.+ | 67.35,17.04 65.41,17.04 65.3,17.15 | 65.3,17.15 65.3,19.53 65.27,19.56 | v64.52,26.67 64.52,25.84 C20.1 | R8.2 v47.5,45.47
VTG
  Bottom 0.406: SV8.3 SV8.4 72.56,14.1 70.84,15.82 70.84,17.07 | 70.84,17.07 70.84,18.2 71.86,19.23 72.53,19.23 SV3.2 SV3.1 76,19.18 76.91,20.09 76.91,43.84 70.11,50.65 SV4.2 SV4.1 | R7.1 70.79,17.02 70.84,17.07

### Text on the board
Bottom: MLAB | 2013
tPlace: POWER | POWER | P61 | P64 | 67 | 68 | P70 | P71 | P72 | P74 | P89 | P90 | P99 | GND | VTG | +5V | +3.3V | P64 | DBGACK1 | DBGRQ1 | TSRST1 | JACHO | TDO1 | 2013 | RTCK1 | POWER | TCK1 | MLAB | TMS1 | J-TAG | TDI1 | TRST1 | JTAGFT2232V02A | MODE | VTG | GND | I/O | JTAG | VTG | GND | 3.3V | 1.8V | P13 | P12 | P11 | P10 | P9 | P8 | P7 | P6 | P4 | P3 | P2 | P1 | GND